# EAGLE design W101X (EAGLE 6.6.0)
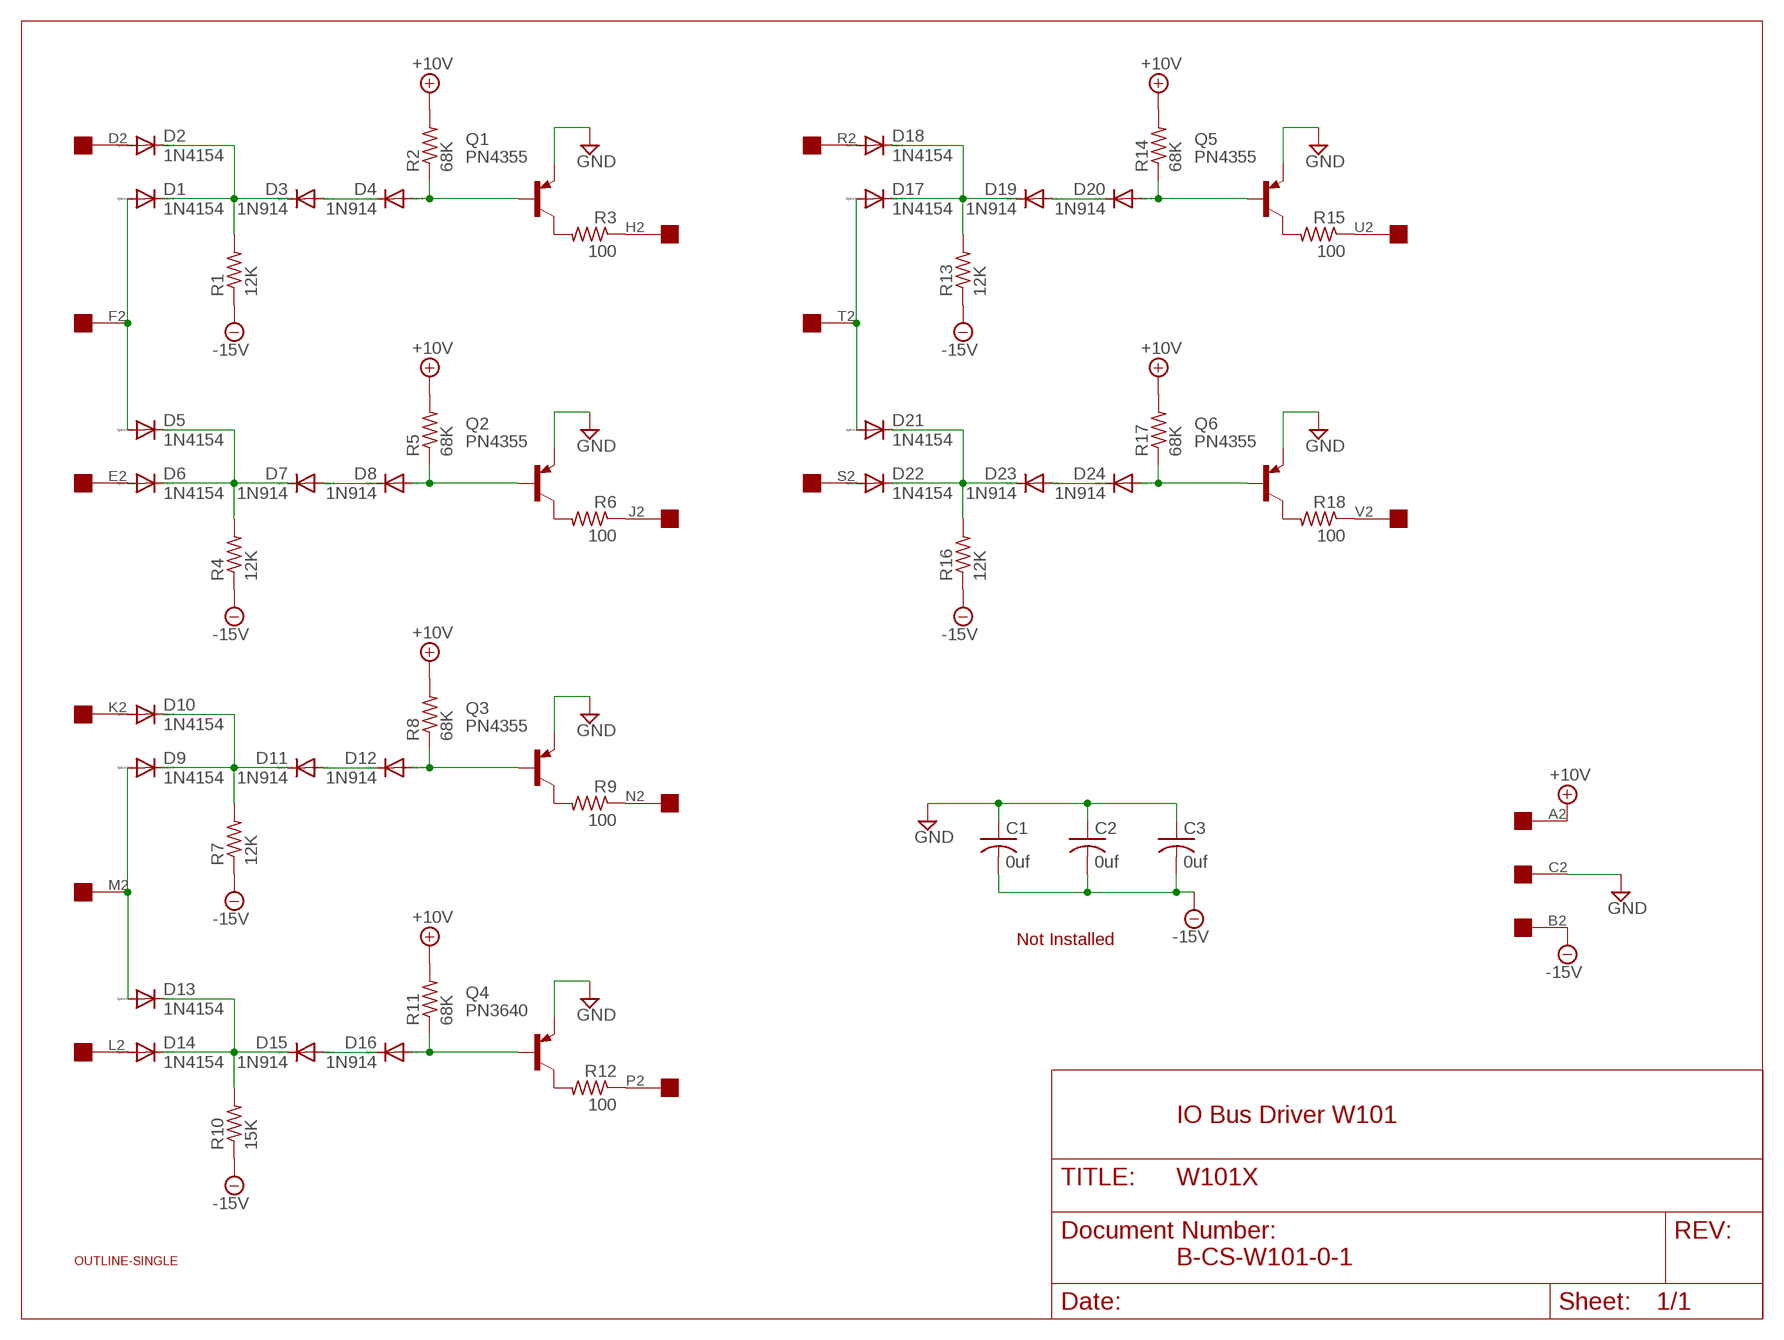
[diagram p0: schematic, sheet 1]

## Parts
C1  0uf  C-US050-025X075  [C050-025X075]
C2  0uf  C-US050-025X075  [C050-025X075]
C3  0uf  C-US050-025X075  [C050-025X075]
D1  1N4154  1N4148DO35-10  [DO35-10]
D2  1N4154  1N4148DO35-10  [DO35-10]
D3  1N914  1N4148DO35-10  [DO35-10]
D4  1N914  1N4148DO35-10  [DO35-10]
D5  1N4154  1N4148DO35-10  [DO35-10]
D6  1N4154  1N4148DO35-10  [DO35-10]
D7  1N914  1N4148DO35-10  [DO35-10]
D8  1N914  1N4148DO35-10  [DO35-10]
D9  1N4154  1N4148DO35-10  [DO35-10]
D10  1N4154  1N4148DO35-10  [DO35-10]
D11  1N914  1N4148DO35-10  [DO35-10]
D12  1N914  1N4148DO35-10  [DO35-10]
D13  1N4154  1N4148DO35-10  [DO35-10]
D14  1N4154  1N4148DO35-10  [DO35-10]
D15  1N914  1N4148DO35-10  [DO35-10]
D16  1N914  1N4148DO35-10  [DO35-10]
D17  1N4154  1N4148DO35-10  [DO35-10]
D18  1N4154  1N4148DO35-10  [DO35-10]
D19  1N914  1N4148DO35-10  [DO35-10]
D20  1N914  1N4148DO35-10  [DO35-10]
D21  1N4154  1N4148DO35-10  [DO35-10]
D22  1N4154  1N4148DO35-10  [DO35-10]
D23  1N914  1N4148DO35-10  [DO35-10]
D24  1N914  1N4148DO35-10  [DO35-10]
Q1  PN4355  2N3637  [TO39]
Q2  PN4355  2N3637  [TO39]
Q3  PN4355  2N3637  [TO39]
Q4  PN3640  2N3637  [TO39]
Q5  PN4355  2N3637  [TO39]
Q6  PN4355  2N3637  [TO39]
R1  12K  R-US_0207/10  [0207/10]
R2  68K  R-US_0207/10  [0207/10]
R3  100  R-US_0207/10  [0207/10]
R4  12K  R-US_0207/10  [0207/10]
R5  68K  R-US_0207/10  [0207/10]
R6  100  R-US_0207/10  [0207/10]
R7  12K  R-US_0207/10  [0207/10]
R8  68K  R-US_0207/10  [0207/10]
R9  100  R-US_0207/10  [0207/10]
R10  15K  R-US_0207/10  [0207/10]
R11  68K  R-US_0207/10  [0207/10]
R12  100  R-US_0207/10  [0207/10]
R13  12K  R-US_0207/10  [0207/10]
R14  68K  R-US_0207/10  [0207/10]
R15  100  R-US_0207/10  [0207/10]
R16  12K  R-US_0207/10  [0207/10]
R17  68K  R-US_0207/10  [0207/10]
R18  100  R-US_0207/10  [0207/10]
U$1  OUTLINE-SINGLE  [SINGLE]
U$2  EDGE-1  [EDGE-CON1]

## Nets
+10V [Power]: R2.2 R5.2 R8.2 R11.2 R14.2 R17.2 U$2.A2
-15V [Power]: C1.2 C2.2 C3.2 R1.1 R4.1 R7.1 R10.1 R13.1 R16.1 U$2.B2
GND [Power]: C1.1 C2.1 C3.1 Q1.1(E) Q2.1(E) Q3.1(E) Q4.1(E) Q5.1(E) Q6.1(E) U$2.C2
N$1: D2.A U$2.D2
N$2: D8.A Q2.2(B) R5.1
N$3: R3.1 U$2.H2
N$4: Q2.3(C) R6.2
N$5: D6.A U$2.E2
N$6: D5.C D6.C D7.C R4.2
N$7: D7.A D8.C
N$8: D12.A Q3.2(B) R8.1
N$9: Q3.3(C) R9.2
N$10: D9.A D13.A U$2.M2
N$11: D9.C D10.C D11.C R7.2
N$12: D11.A D12.C
N$13: R6.1 U$2.J2
N$14: D10.A U$2.K2
N$15: R9.1 U$2.N2
N$16: R12.1 U$2.P2
N$17: D18.A U$2.R2
N$18: R15.1 U$2.U2
N$19: D4.A Q1.2(B) R2.1
N$20: Q1.3(C) R3.2
N$21: D1.A D5.A U$2.F2
N$22: D1.C D2.C D3.C R1.2
N$23: D3.A D4.C
N$24: D16.A Q4.2(B) R11.1
N$25: Q4.3(C) R12.2
N$26: D14.A U$2.L2
N$27: D13.C D14.C D15.C R10.2
N$28: D15.A D16.C
N$29: D20.A Q5.2(B) R14.1
N$30: Q5.3(C) R15.2
N$31: D17.A D21.A U$2.T2
N$32: D17.C D18.C D19.C R13.2
N$33: D19.A D20.C
N$34: D24.A Q6.2(B) R17.1
N$35: Q6.3(C) R18.2
N$36: D22.A U$2.S2
N$37: D21.C D22.C D23.C R16.2
N$38: D23.A D24.C
N$39: R18.1 U$2.V2

## Notes on the sheet
- Not Installed
- IO Bus Driver W101
- B-CS-W101-0-1

## Library data of the parts
C1-C3 = rcl:C-US: CAPACITOR, American symbol
D1-D24 = diode:1N4148: DIODE high speed (Philips)
Q1-Q6 = transistor-pnp:2N3637*: PNP Transistror
R1-R18 = rcl:R-US_: RESISTOR, American symbol
U$1 = dec-con:OUTLINE-*: Board outlines for DEC boards.
U$2 = dec-con:EDGE-1: Single-Sided DEC Edge Connector -- (side 2)

## Net classes
1 Power: width 0.813 mm

## Board
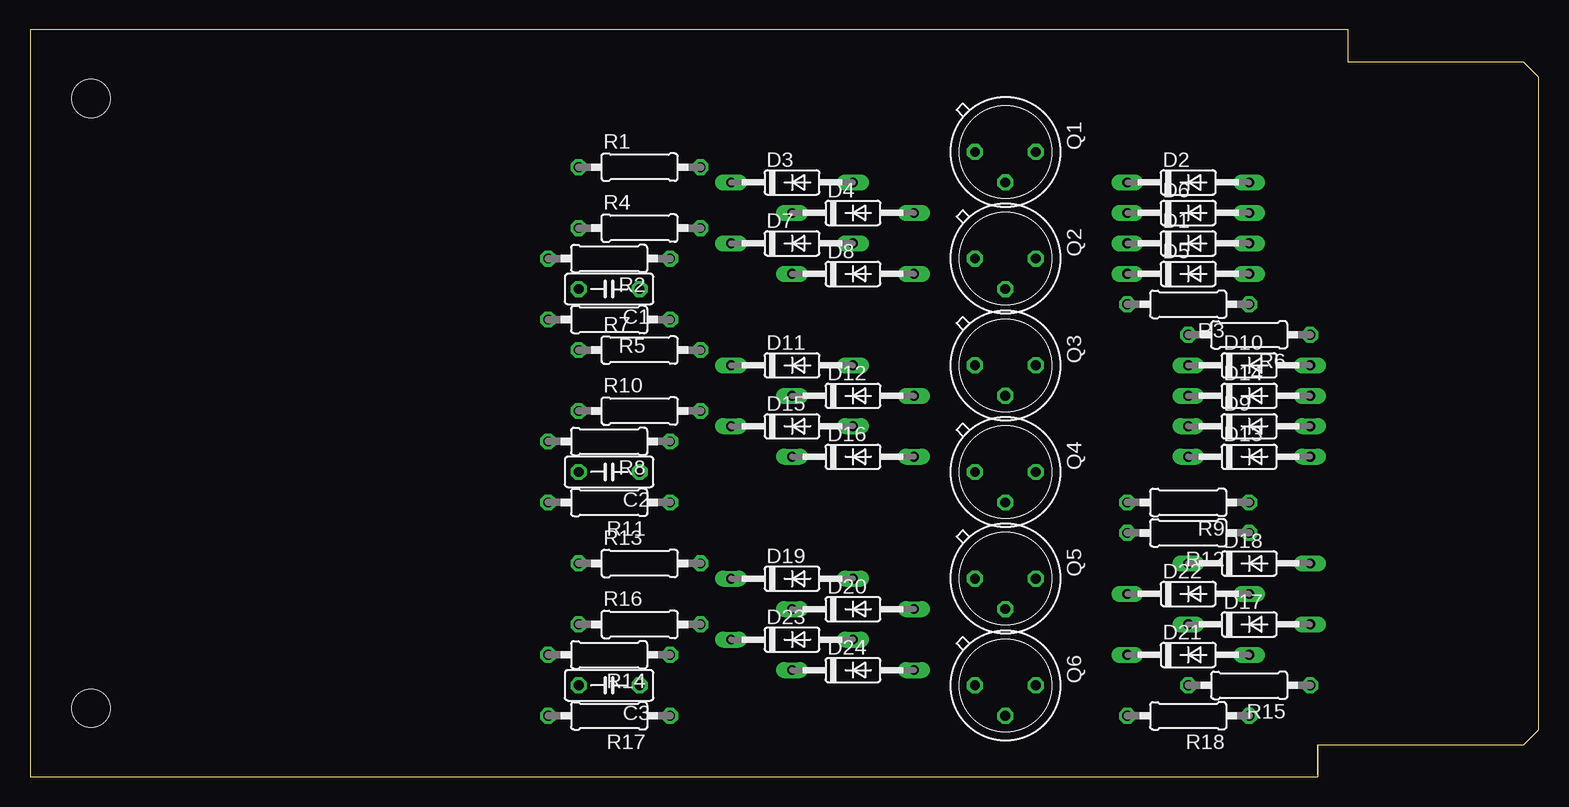
[diagram p1: board, top side]
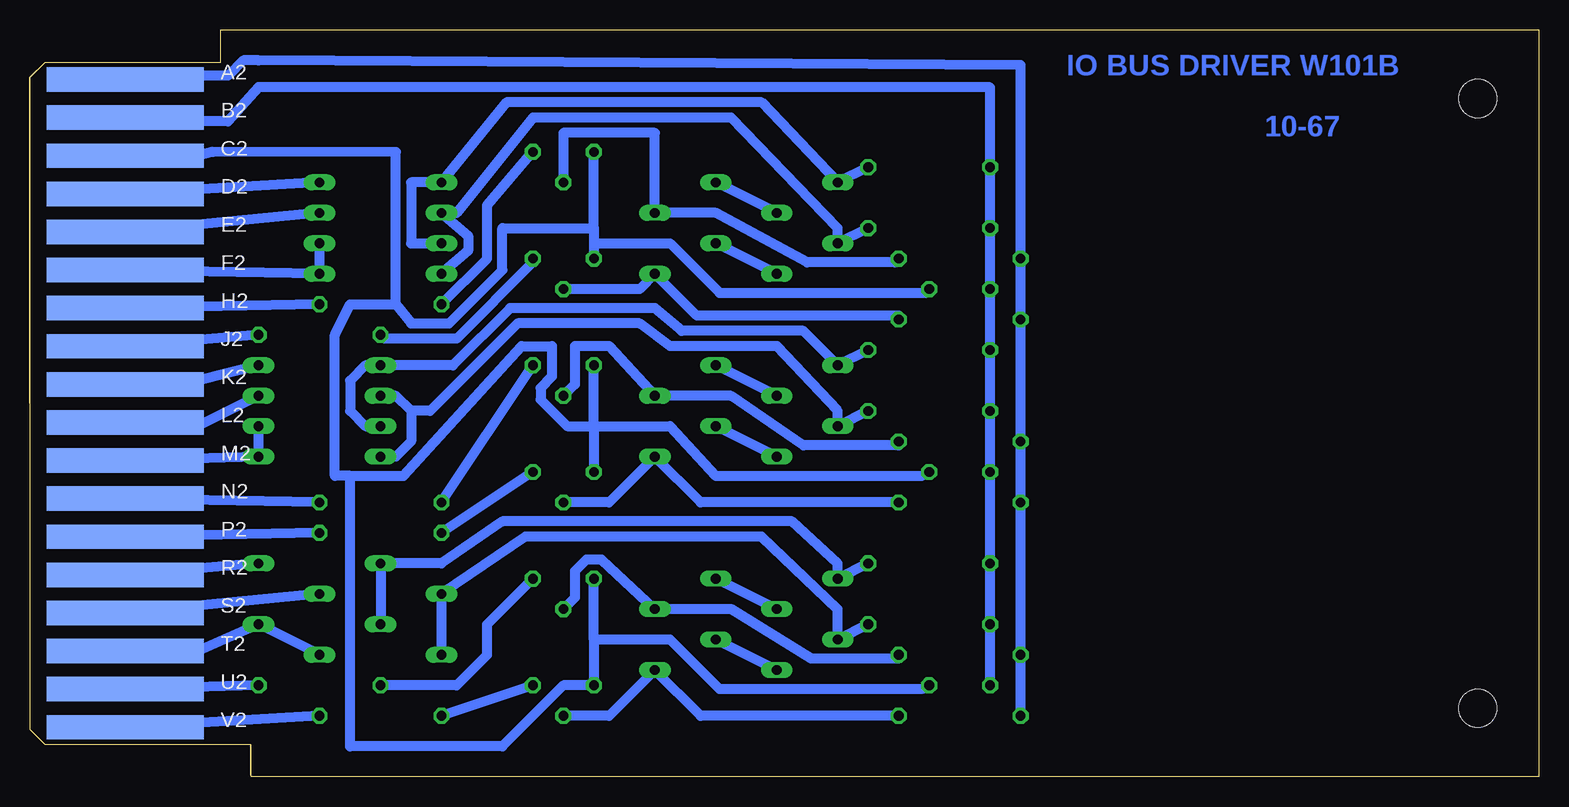
[diagram p2: board, bottom side, seen from below]

Size 125.73 x 62.23 mm. Coordinates in mm from the lower left corner, seen from the top.
Copper layers (1+16): Top 0.035mm / dielectric 1.5mm / Bottom 0.035mm
Design rules "16mils": minimum track width 16mil, minimum drill 32mil, track to track 15mil, track to pad 10mil, pad to pad 10mil, via to via 10mil, smd to smd 10mil, copper to edge 13mil, drill to drill 10mil, minimum pad ring 10mil, minimum via ring 8mil, stop-mask expansion 0mil, vias tented up to drill 0mil, thermal gap 10mil

### Footprints (pad centres in the part's own frame; a part is rotated, then mirrored left to right if it is on the bottom)
C050-025X075 = drill 0.813 octagon: 1 -2.54,0; 2 2.54,0
DO35-10 = drill 0.813 long: A 5.08,0; C -5.08,0
TO39 = drill 0.813 octagon: 1 0,-2.54; 2 2.54,0; 3 0,2.54
0207/10 = drill 0.813 octagon: 1 -5.08,0; 2 5.08,0
SINGLE = hole 3.175: 120.65,56.515; 120.65,5.715
EDGE-CON1 = smd 13.106 x 2.032 bottom: A2 7.938,4.128; B2 7.938,7.303; C2 7.938,10.477; D2 7.938,13.652; E2 7.938,16.828; F2 7.938,20.003; H2 7.938,23.177; J2 7.938,26.352; K2 7.938,29.527; L2 7.938,32.703; M2 7.938,35.877; N2 7.938,39.053; P2 7.938,42.227; R2 7.938,45.403; S2 7.938,48.578; T2 7.938,51.752; U2 7.938,54.928; V2 7.938,58.102

### Placement (x,y rotation side)
C1  48.26,40.64 180 top
C2  48.26,25.4 180 top
C3  48.26,7.62 180 top
D1  96.52,44.45 0 top
D2  96.52,49.53 0 top
D3  63.5,49.53 0 top
D4  68.58,46.99 0 top
D5  96.52,41.91 0 top
D6  96.52,46.99 0 top
D7  63.5,44.45 0 top
D8  68.58,41.91 0 top
D9  101.6,29.21 0 top
D10  101.6,34.29 0 top
D11  63.5,34.29 0 top
D12  68.58,31.75 0 top
D13  101.6,26.67 0 top
D14  101.6,31.75 0 top
D15  63.5,29.21 0 top
D16  68.58,26.67 0 top
D17  101.6,12.7 0 top
D18  101.6,17.78 0 top
D19  63.5,16.51 0 top
D20  68.58,13.97 0 top
D21  96.52,10.16 0 top
D22  96.52,15.24 0 top
D23  63.5,11.43 0 top
D24  68.58,8.89 0 top
Q1  81.28,52.07 270 top
Q2  81.28,43.18 270 top
Q3  81.28,34.29 270 top
Q4  81.28,25.4 270 top
Q5  81.28,16.51 270 top
Q6  81.28,7.62 270 top
R1  50.8,50.8 0 top
R2  48.26,43.18 180 top
R3  96.52,39.37 180 top
R4  50.8,45.72 0 top
R5  48.26,38.1 180 top
R6  101.6,36.83 180 top
R7  50.8,35.56 0 top
R8  48.26,27.94 180 top
R9  96.52,22.86 180 top
R10  50.8,30.48 0 top
R11  48.26,22.86 180 top
R12  96.52,20.32 180 top
R13  50.8,17.78 0 top
R14  48.26,10.16 180 top
R15  101.6,7.62 180 top
R16  50.8,12.7 0 top
R17  48.26,5.08 180 top
R18  96.52,5.08 180 top
U$1  125.73,62.23 180 top
U$2  125.73,62.23 180 top

### Tracks (layer width: path | path; a pad name or v marks a point on that pad's centre or on a via)
+10V
  Bottom 0.813: R17.2 R14.2 R11.2 R8.2 R5.2 R2.2 43.18,59.31 106.68,59.69 107.95,59.69 109.22,58.42 117.66,58.42 U$2.A2
-15V
  Bottom 0.813: U$2.B2 118.06,54.61 109.22,54.61 106.68,57.47 45.72,57.44 R1.1 R4.1 C1.2 R7.1 R10.1 C2.2 R13.1 R16.1 C3.2
GND
  Bottom 0.813: 78.74,44.45 Q2.1 | 78.74,45.72 78.74,44.45 | 78.74,45.72 Q1.1 | 78.74,29.21 Q4.1 | 78.74,29.21 Q3.1 | 78.74,11.43 Q6.1 81.28,7.62 86.36,2.54 99.06,2.54 99.06,25.08 | 78.74,11.43 Q5.1 | C3.1 51.44,7.3 68.26,7.3 72.39,11.43 78.74,11.43 | C2.1 51.44,25.08 68.58,25.08 72.39,29.21 78.74,29.21 | C1.1 51.12,40.32 68.26,40.32 72.39,44.45 78.74,44.45 | U$2.C2 111.76,51.74 110.49,52.07 95.26,52.06 95.25,52.07 95.25,39.37 | 95.25,39.37 93.98,37.78 90.81,37.78 86.36,42.23 86.36,45.72 78.74,45.72 | 95.25,39.37 99.06,39.37 100.33,36.83 100.33,25.08 99.06,25.08 | 99.06,25.08 94.61,25.08 84.77,35.88 82.23,35.88 82.23,33.34 83.19,32.38 83.19,31.43 80.96,29.21 78.74,29.21
N$1
  Bottom 0.813: D2.A U$2.D2
N$2
  Bottom 0.813: Q2.2 74.93,40.64 D8.A 70.17,38.42 53.34,38.42 R5.1
N$3
  Bottom 0.813: R3.1 U$2.H2
N$4
  Bottom 0.813: Q2.3 83.82,42.86 90.17,36.51 96.2,36.51 R6.2
N$5
  Bottom 0.813: D6.A U$2.E2
N$6
  Bottom 0.813: R4.2 D7.C 58.42,45.72 67.31,54.93 83.82,54.93 90.17,46.99 D6.C 89.22,45.09 89.22,43.81 D5.C
N$7
  Bottom 0.813: D8.C D7.A
N$8
  Bottom 0.813: Q3.2 80.33,32.7 80.33,35.88 77.47,35.88 D12.A 67.31,31.75 61.28,27.62 53.34,27.62 R8.1
N$9
  Bottom 0.813: R9.2 Q3.3
N$10
  Bottom 0.813: U$2.M2 D13.A D9.A
N$11
  Bottom 0.813: R7.2 D11.C 61.28,37.15 71.44,37.15 73.66,39.05 85.72,39.05 90.49,34.29 D10.C 97.79,34.29 99.06,33.02 99.06,30.48 97.79,29.21 D9.C
N$12
  Bottom 0.813: D12.C D11.A
N$13
  Bottom 0.813: R6.1 U$2.J2
N$14
  Bottom 0.813: U$2.K2 111.76,33.02 D10.A
N$15
  Bottom 0.813: R9.1 U$2.N2
N$16
  Bottom 0.813: R12.1 U$2.P2
N$17
  Bottom 0.813: D18.A U$2.R2
N$18
  Bottom 0.813: R15.1 U$2.U2
N$19
  Bottom 0.813: R2.1 53.66,42.86 60.96,42.86 68.58,46.99 D4.A 73.66,53.66 81.28,53.66 Q1.2
N$20
  Bottom 0.813: R3.2 87.63,43.18 87.63,47.62 Q1.3
N$21
  Bottom 0.813: U$2.F2 D5.A D1.A
N$22
  Bottom 0.813: R1.2 D3.C 64.77,56.2 86.04,56.2 D2.C 93.98,49.53 93.98,44.45 D1.C
N$23
  Bottom 0.813: D4.C D3.A
N$24
  Bottom 0.813: Q4.2 77.47,22.86 D16.A 69.85,22.86 R11.1
N$25
  Bottom 0.813: Q4.3 R12.2
N$26
  Bottom 0.813: U$2.L2 111.76,29.21 D14.A
N$27
  Bottom 0.813: R10.2 D15.C 58.42,30.48 63.5,35.88 72.39,35.88 74.93,37.78 85.09,37.78 92.39,30.48 93.98,30.48 | D13.C 95.25,26.67 93.98,27.94 93.98,30.48 | 93.98,30.48 95.25,31.75 D14.C
N$28
  Bottom 0.813: D16.C D15.A
N$29
  Bottom 0.813: Q5.2 80.33,14.92 80.33,17.14 79.38,18.1 78.11,18.1 D20.A 67.31,13.97 60.64,9.84 53.34,9.84 R14.1
N$30
  Bottom 0.813: R15.2 90.17,7.62 87.63,10.16 87.63,12.7 Q5.3
N$31
  Bottom 0.813: U$2.T2 111.76,10.48 D17.A D21.A
N$32
  Bottom 0.813: R13.2 D19.C 58.42,17.78 62.23,21.27 86.36,21.27 91.44,17.78 D18.C D17.C
N$33
  Bottom 0.813: D20.C D19.A
N$34
  Bottom 0.813: Q6.2 77.47,5.08 D24.A 69.85,5.08 R17.1
N$35
  Bottom 0.813: Q6.3 R18.2
N$36
  Bottom 0.813: D22.A U$2.S2
N$37
  Bottom 0.813: R16.2 D23.C 58.42,13.97 64.77,20 84.45,20 D22.C D21.C
N$38
  Bottom 0.813: D24.C D23.A
N$39
  Bottom 0.813: R18.1 U$2.V2

### Text on the board
Bottom: IO BUS DRIVER W101B | 10-67